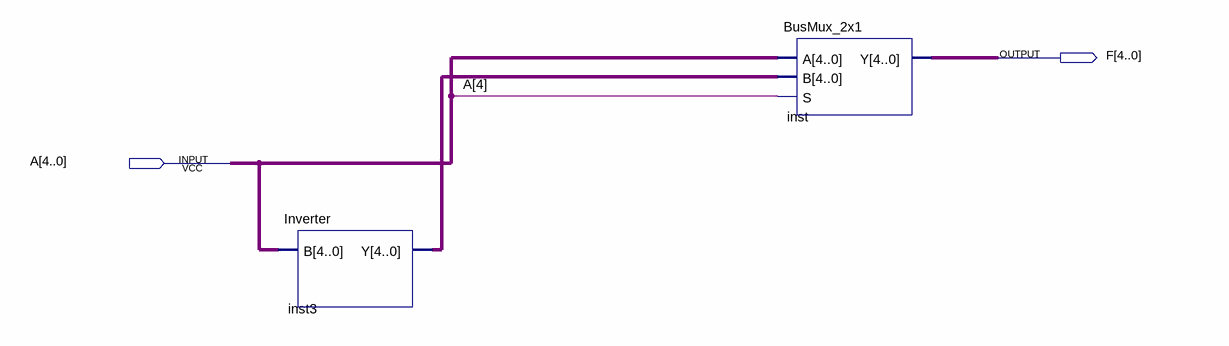
[diagram p0: schematic sheet]
// Quartus schematic Mod_A.bdf as structural Verilog: 2 symbols, 2 pins
module Mod_A (
  input  [4:0] A,
  output [4:0] F
);

  wire [4:0] inst3_y;

  Inverter inst3 (.B(A), .Y(inst3_y));
  BusMux_2x1 inst (.A(A), .B(inst3_y), .S(A[4]), .Y(F));
endmodule
